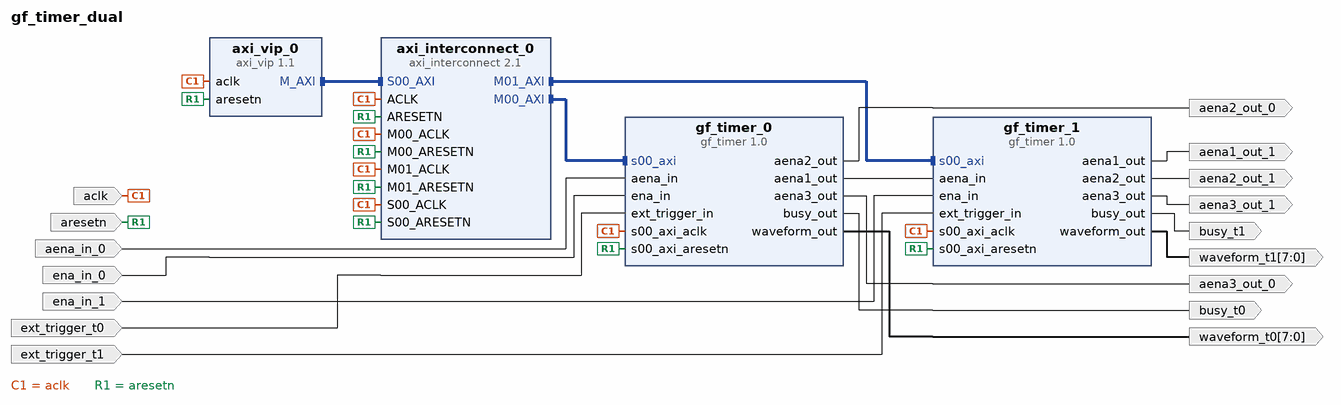
[diagram p0: block diagram of the top level]
# Vivado block design gf_timer_dual, xczu9eg-ffvc900-1-e, Vivado 2025.1
create_bd_design gf_timer_dual

create_bd_port -dir I -type clk aclk
create_bd_port -dir I -type rst aresetn
set_property -dict {CONFIG.POLARITY ACTIVE_LOW} [get_bd_ports aresetn]
create_bd_port -dir O -from 7 -to 0 waveform_t0
create_bd_port -dir O -from 7 -to 0 waveform_t1
create_bd_port -dir O busy_t0
create_bd_port -dir O busy_t1
create_bd_port -dir I ext_trigger_t0
create_bd_port -dir I ext_trigger_t1
create_bd_port -dir I ena_in_0
create_bd_port -dir O aena2_out_0
create_bd_port -dir O aena3_out_0
create_bd_port -dir O aena1_out_1
create_bd_port -dir O aena2_out_1
create_bd_port -dir O aena3_out_1
create_bd_port -dir I aena_in_0
create_bd_port -dir I ena_in_1

create_bd_cell -type ip -vlnv xilinx.com:ip:axi_vip:1.1 axi_vip_0
set_property -dict [list \
  CONFIG.ADDR_WIDTH 32 \
  CONFIG.DATA_WIDTH 32 \
  CONFIG.HAS_BRESP 1 \
  CONFIG.HAS_PROT 1 \
  CONFIG.HAS_RRESP 1 \
  CONFIG.HAS_WSTRB 1 \
  CONFIG.INTERFACE_MODE MASTER \
  CONFIG.PROTOCOL AXI4LITE \
  CONFIG.READ_WRITE_MODE READ_WRITE \
] [get_bd_cells axi_vip_0]
create_bd_cell -type ip -vlnv xilinx.com:ip:axi_interconnect:2.1 axi_interconnect_0
set_property -dict {CONFIG.NUM_MI 2} [get_bd_cells axi_interconnect_0]
create_bd_cell -type ip -vlnv user:user:gf_timer:1.0 gf_timer_0
create_bd_cell -type ip -vlnv user:user:gf_timer:1.0 gf_timer_1

# ---- connections ----

connect_bd_intf_net [get_bd_intf_pins axi_interconnect_0/M00_AXI] [get_bd_intf_pins gf_timer_0/s00_axi]
connect_bd_intf_net [get_bd_intf_pins axi_interconnect_0/M01_AXI] [get_bd_intf_pins gf_timer_1/s00_axi]
connect_bd_intf_net [get_bd_intf_pins axi_vip_0/M_AXI] [get_bd_intf_pins axi_interconnect_0/S00_AXI]
connect_bd_net [get_bd_ports aclk] \
  [get_bd_pins axi_interconnect_0/ACLK] [get_bd_pins axi_interconnect_0/S00_ACLK] [get_bd_pins axi_interconnect_0/M00_ACLK] \
  [get_bd_pins axi_interconnect_0/M01_ACLK] [get_bd_pins axi_vip_0/aclk] [get_bd_pins gf_timer_0/s00_axi_aclk] \
  [get_bd_pins gf_timer_1/s00_axi_aclk]
connect_bd_net -net aena_in_0_1 [get_bd_ports aena_in_0] [get_bd_pins gf_timer_0/aena_in]
connect_bd_net [get_bd_ports aresetn] \
  [get_bd_pins axi_interconnect_0/ARESETN] [get_bd_pins axi_interconnect_0/S00_ARESETN] \
  [get_bd_pins axi_interconnect_0/M00_ARESETN] [get_bd_pins axi_interconnect_0/M01_ARESETN] [get_bd_pins axi_vip_0/aresetn] \
  [get_bd_pins gf_timer_0/s00_axi_aresetn] [get_bd_pins gf_timer_1/s00_axi_aresetn]
connect_bd_net -net ena_in_0_1 [get_bd_ports ena_in_0] [get_bd_pins gf_timer_0/ena_in]
connect_bd_net -net ena_in_1_1 [get_bd_ports ena_in_1] [get_bd_pins gf_timer_1/ena_in]
connect_bd_net -net ext_trigger_t0_1 [get_bd_ports ext_trigger_t0] [get_bd_pins gf_timer_0/ext_trigger_in]
connect_bd_net -net ext_trigger_t1_1 [get_bd_ports ext_trigger_t1] [get_bd_pins gf_timer_1/ext_trigger_in]
connect_bd_net [get_bd_pins gf_timer_0/aena1_out] [get_bd_pins gf_timer_1/aena_in]
connect_bd_net [get_bd_pins gf_timer_0/aena2_out] [get_bd_ports aena2_out_0]
connect_bd_net [get_bd_pins gf_timer_0/aena3_out] [get_bd_ports aena3_out_0]
connect_bd_net [get_bd_pins gf_timer_0/busy_out] [get_bd_ports busy_t0]
connect_bd_net [get_bd_pins gf_timer_0/waveform_out] [get_bd_ports waveform_t0]
connect_bd_net [get_bd_pins gf_timer_1/aena1_out] [get_bd_ports aena1_out_1]
connect_bd_net [get_bd_pins gf_timer_1/aena2_out] [get_bd_ports aena2_out_1]
connect_bd_net [get_bd_pins gf_timer_1/aena3_out] [get_bd_ports aena3_out_1]
connect_bd_net [get_bd_pins gf_timer_1/busy_out] [get_bd_ports busy_t1]
connect_bd_net [get_bd_pins gf_timer_1/waveform_out] [get_bd_ports waveform_t1]

# ---- address map ----
assign_bd_address -offset 0x00000000 -range 4K -target_address_space [get_bd_addr_spaces axi_vip_0/Master_AXI] [get_bd_addr_segs gf_timer_0/s00_axi/reg0]
assign_bd_address -offset 0x00010000 -range 4K -target_address_space [get_bd_addr_spaces axi_vip_0/Master_AXI] [get_bd_addr_segs gf_timer_1/s00_axi/reg0]

validate_bd_design
save_bd_design
